# EAGLE design X15-Backplane (EAGLE 9.6.2)

## Sheet 1 of 2
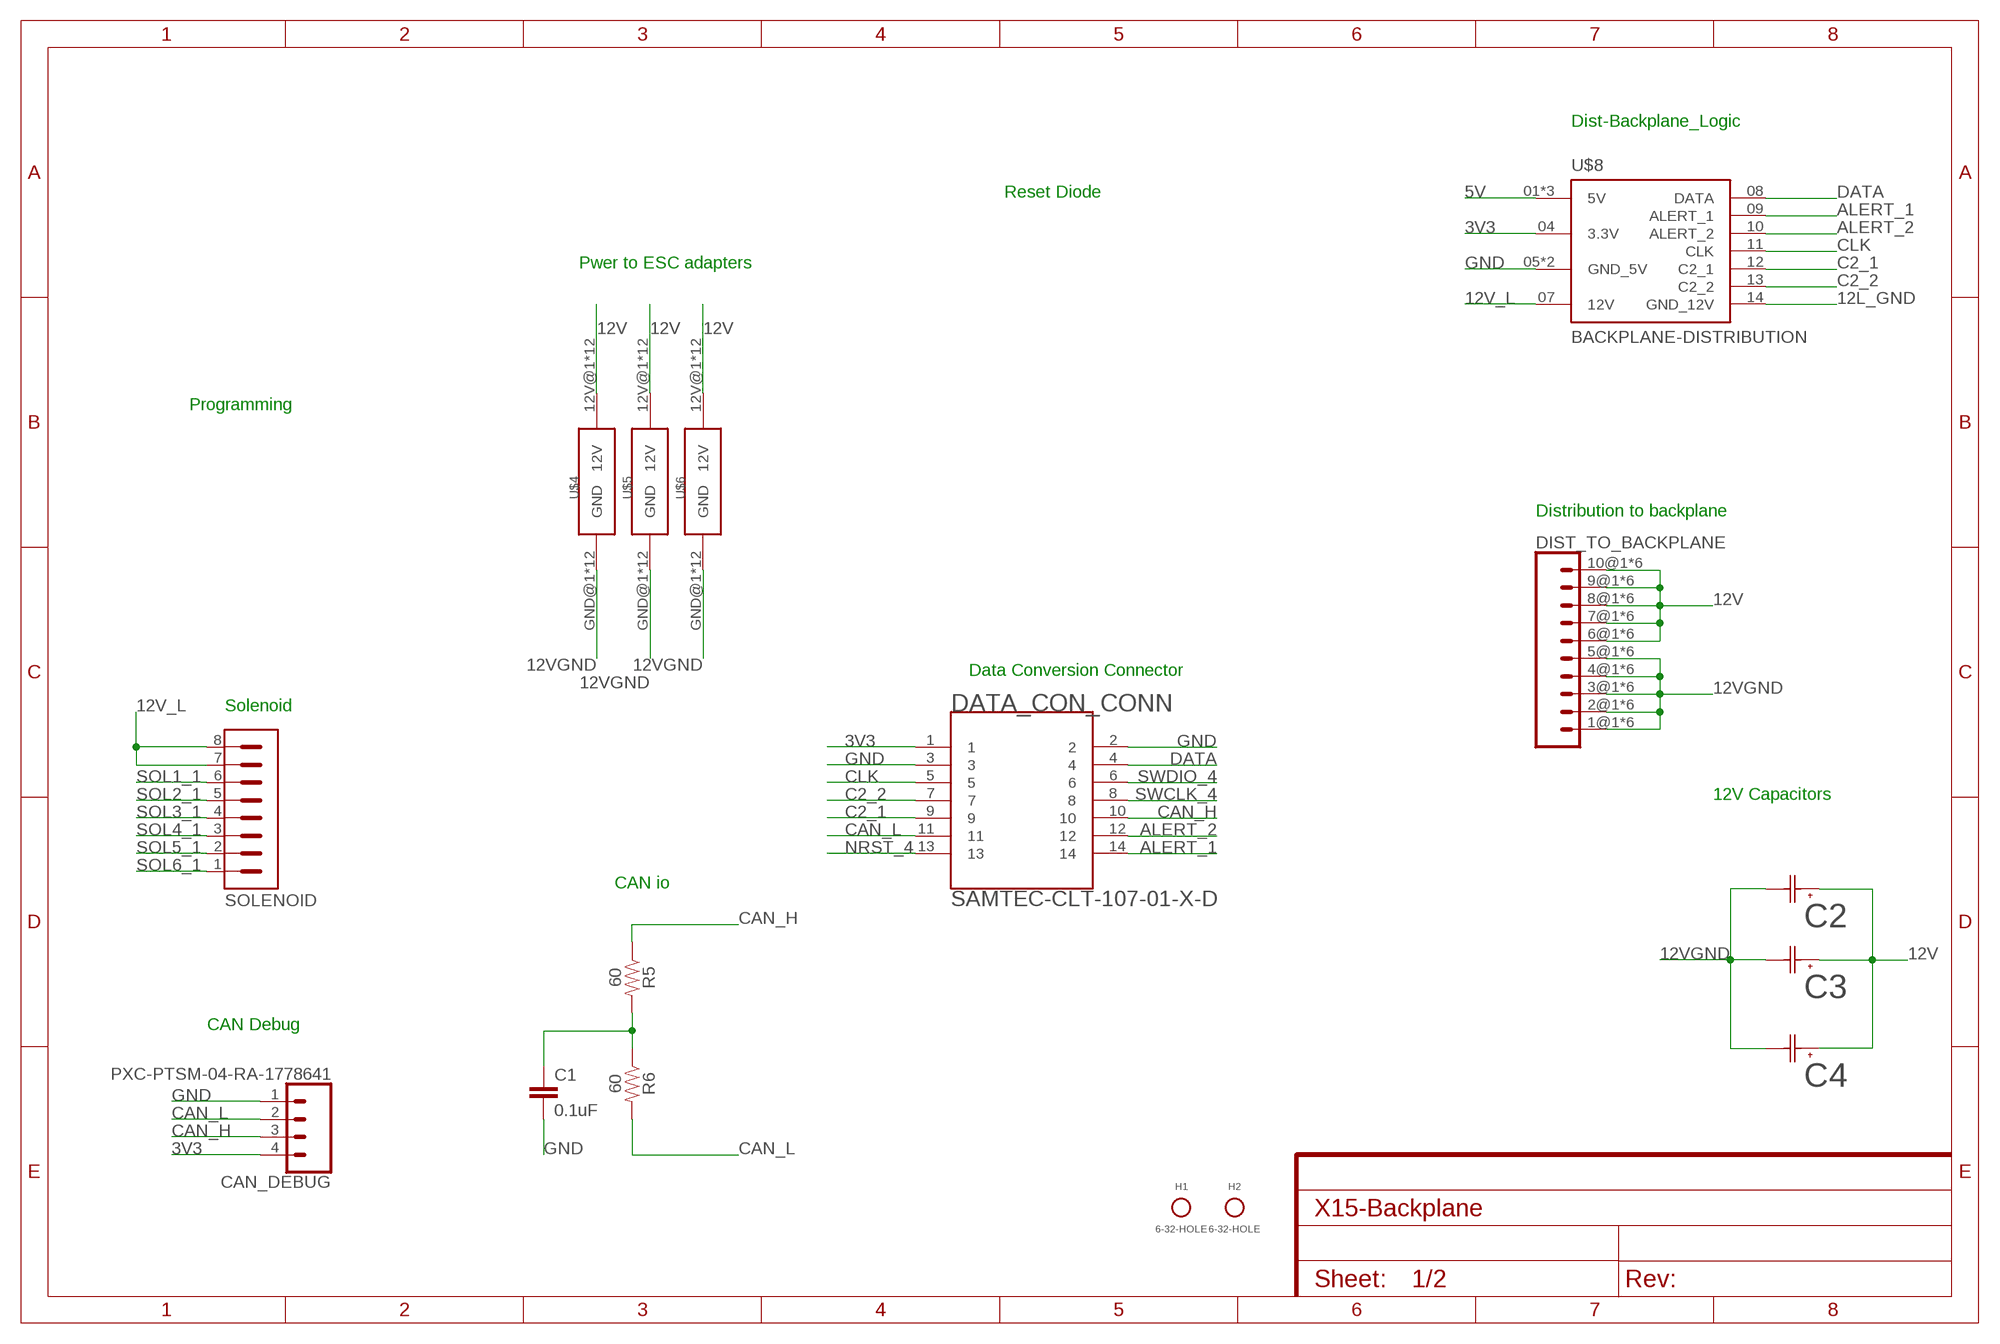
[diagram p0: schematic, sheet 1]

### Parts
C1  0.1uF  0.1UF-0603-100V-10%  [0603]
C2  UCV1E561MNL1GSCAP_UCD_8X10_NCH  [CAP_UCD_8X10_NCH]
C3  UCV1E561MNL1GSCAP_UCD_8X10_NCH  [CAP_UCD_8X10_NCH]
C4  UCV1E561MNL1GSCAP_UCD_8X10_NCH  [CAP_UCD_8X10_NCH]
CAN_DEBUG  PXC-PTSM-04-RA-1778641  [PXC-PTSM-04-RA-1778641]
DATA_CON_CONN  BACKPLANE->DATACONV  [SAMTEC-CLT-107-01-X-D-BACKPLANE]
DIST_TO_BACKPLANE  MPPT-10-01-01-L-RA-SD  [MPPT-10-01-01-L-RA-SD]
H1  6-32-HOLE  [6-32-HOLE]
H2  6-32-HOLE  [6-32-HOLE]
R5  60  RESISTOR0603  [0603]
R6  60  RESISTOR0603  [0603]
SOLENOID  PXC-8-RA-1778683  [PXC-8-RA-1778683]
U$4  BACKPLANE_ESC_ADAPTER_PWRBKP  [BACKPLANE_ESC_ADAPTER_BKP_PWR]
U$5  BACKPLANE_ESC_ADAPTER_PWRBKP  [BACKPLANE_ESC_ADAPTER_BKP_PWR]
U$6  BACKPLANE_ESC_ADAPTER_PWRBKP  [BACKPLANE_ESC_ADAPTER_BKP_PWR]
U$8  BACKPLANE-DISTRIBUTION  [SAMTEC_IPL1-107-01-X-D-K(B-D)]

### Nets
3V3: CAN_DEBUG.4 DATA_CON_CONN.1 U$8.04(3.3V) ; also sheet 2
5V: U$8.01(5V) U$8.02(5V) U$8.03(5V) ; also sheet 2
12L_GND: U$8.14(GND_12V) ; also sheet 2
12V: C2.1 C3.1 C4.1 DIST_TO_BACKPLANE.6@1 DIST_TO_BACKPLANE.6@2 DIST_TO_BACKPLANE.6@3 DIST_TO_BACKPLANE.6@4 DIST_TO_BACKPLANE.6@5 DIST_TO_BACKPLANE.6@6 DIST_TO_BACKPLANE.7@1 DIST_TO_BACKPLANE.7@2 DIST_TO_BACKPLANE.7@3 DIST_TO_BACKPLANE.7@4 DIST_TO_BACKPLANE.7@5 DIST_TO_BACKPLANE.7@6 DIST_TO_BACKPLANE.8@1 DIST_TO_BACKPLANE.8@2 DIST_TO_BACKPLANE.8@3 DIST_TO_BACKPLANE.8@4 DIST_TO_BACKPLANE.8@5 DIST_TO_BACKPLANE.8@6 DIST_TO_BACKPLANE.9@1 DIST_TO_BACKPLANE.9@2 DIST_TO_BACKPLANE.9@3 DIST_TO_BACKPLANE.9@4 DIST_TO_BACKPLANE.9@5 DIST_TO_BACKPLANE.9@6 DIST_TO_BACKPLANE.10@1 DIST_TO_BACKPLANE.10@2 DIST_TO_BACKPLANE.10@3 DIST_TO_BACKPLANE.10@4 DIST_TO_BACKPLANE.10@5 DIST_TO_BACKPLANE.10@6 U$4.12V@1(12V) U$4.12V@2(12V) U$4.12V@3(12V) U$4.12V@4(12V) U$4.12V@5(12V) U$4.12V@6(12V) U$4.12V@7(12V) U$4.12V@8(12V) U$4.12V@9(12V) U$4.12V@10(12V) U$4.12V@11(12V) U$4.12V@12(12V) U$5.12V@1(12V) U$5.12V@2(12V) U$5.12V@3(12V) U$5.12V@4(12V) U$5.12V@5(12V) U$5.12V@6(12V) U$5.12V@7(12V) U$5.12V@8(12V) U$5.12V@9(12V) U$5.12V@10(12V) U$5.12V@11(12V) U$5.12V@12(12V) U$6.12V@1(12V) U$6.12V@2(12V) U$6.12V@3(12V) U$6.12V@4(12V) U$6.12V@5(12V) U$6.12V@6(12V) U$6.12V@7(12V) U$6.12V@8(12V) U$6.12V@9(12V) U$6.12V@10(12V) U$6.12V@11(12V) U$6.12V@12(12V) ; also sheet 2
12V_L: SOLENOID.7 SOLENOID.8 U$8.07(12V) ; also sheet 2
12VGND: C2.2 C3.2 C4.2 DIST_TO_BACKPLANE.1@1 DIST_TO_BACKPLANE.1@2 DIST_TO_BACKPLANE.1@3 DIST_TO_BACKPLANE.1@4 DIST_TO_BACKPLANE.1@5 DIST_TO_BACKPLANE.1@6 DIST_TO_BACKPLANE.2@1 DIST_TO_BACKPLANE.2@2 DIST_TO_BACKPLANE.2@3 DIST_TO_BACKPLANE.2@4 DIST_TO_BACKPLANE.2@5 DIST_TO_BACKPLANE.2@6 DIST_TO_BACKPLANE.3@1 DIST_TO_BACKPLANE.3@2 DIST_TO_BACKPLANE.3@3 DIST_TO_BACKPLANE.3@4 DIST_TO_BACKPLANE.3@5 DIST_TO_BACKPLANE.3@6 DIST_TO_BACKPLANE.4@1 DIST_TO_BACKPLANE.4@2 DIST_TO_BACKPLANE.4@3 DIST_TO_BACKPLANE.4@4 DIST_TO_BACKPLANE.4@5 DIST_TO_BACKPLANE.4@6 DIST_TO_BACKPLANE.5@1 DIST_TO_BACKPLANE.5@2 DIST_TO_BACKPLANE.5@3 DIST_TO_BACKPLANE.5@4 DIST_TO_BACKPLANE.5@5 DIST_TO_BACKPLANE.5@6 U$4.GND@1(GND) U$4.GND@2(GND) U$4.GND@3(GND) U$4.GND@4(GND) U$4.GND@5(GND) U$4.GND@6(GND) U$4.GND@7(GND) U$4.GND@8(GND) U$4.GND@9(GND) U$4.GND@10(GND) U$4.GND@11(GND) U$4.GND@12(GND) U$5.GND@1(GND) U$5.GND@2(GND) U$5.GND@3(GND) U$5.GND@4(GND) U$5.GND@5(GND) U$5.GND@6(GND) U$5.GND@7(GND) U$5.GND@8(GND) U$5.GND@9(GND) U$5.GND@10(GND) U$5.GND@11(GND) U$5.GND@12(GND) U$6.GND@1(GND) U$6.GND@2(GND) U$6.GND@3(GND) U$6.GND@4(GND) U$6.GND@5(GND) U$6.GND@6(GND) U$6.GND@7(GND) U$6.GND@8(GND) U$6.GND@9(GND) U$6.GND@10(GND) U$6.GND@11(GND) U$6.GND@12(GND)
ALERT_1: DATA_CON_CONN.14 U$8.09(ALERT_1)
ALERT_2: DATA_CON_CONN.12 U$8.10(ALERT_2)
C2_1: DATA_CON_CONN.9 U$8.12(C2_1)
C2_2: DATA_CON_CONN.7 U$8.13(C2_2)
CAN_H: CAN_DEBUG.3 DATA_CON_CONN.10 R5.1 ; also sheet 2
CAN_L: CAN_DEBUG.2 DATA_CON_CONN.11 R6.2 ; also sheet 2
CLK: DATA_CON_CONN.5 U$8.11(CLK)
DATA: DATA_CON_CONN.4 U$8.08(DATA)
GND: C1.2 CAN_DEBUG.1 DATA_CON_CONN.2 DATA_CON_CONN.3 U$8.05(GND_5V) U$8.06(GND_5V) ; also sheet 2
N$4: C1.1 R5.2 R6.1
NRST_4: DATA_CON_CONN.13
SOL1_1: SOLENOID.6 ; also sheet 2
SOL2_1: SOLENOID.5 ; also sheet 2
SOL3_1: SOLENOID.4 ; also sheet 2
SOL4_1: SOLENOID.3 ; also sheet 2
SOL5_1: SOLENOID.2 ; also sheet 2
SOL6_1: SOLENOID.1 ; also sheet 2
SWCLK_4: DATA_CON_CONN.8
SWDIO_4: DATA_CON_CONN.6

### Notes on the sheet
- Dist-Backplane_Logic
- Reset Diode
- Pwer to ESC adapters
- Programming
- Distribution to backplane
- Data Conversion Connector
- Solenoid
- 12V Capacitors
- CAN io
- CAN Debug

## Sheet 2 of 2
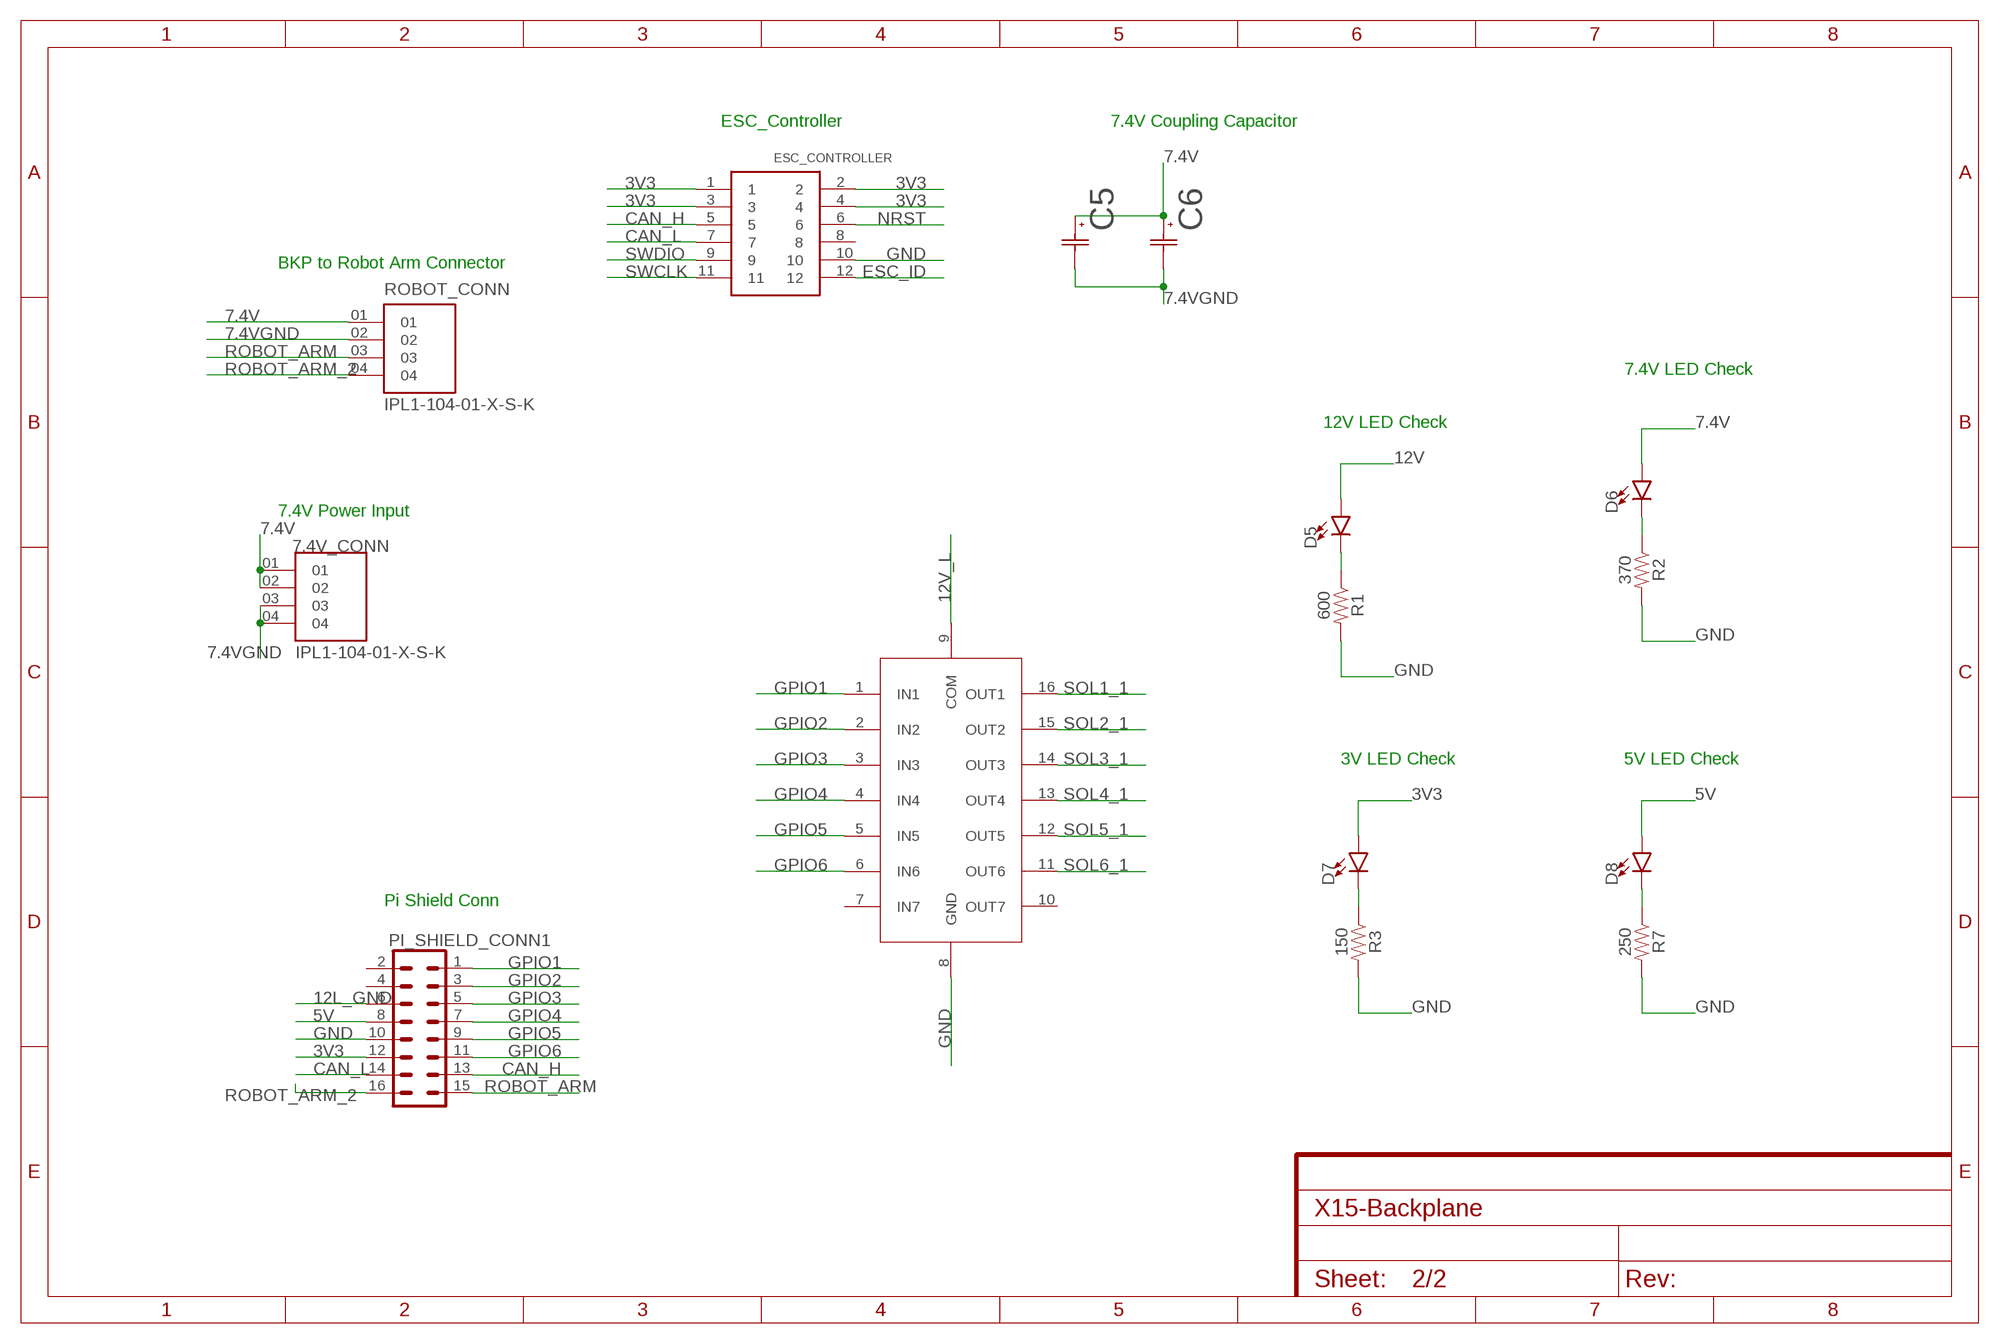
[diagram p1: schematic, sheet 2]

### Parts
7.4V_CONN  IPL1-104-01-X-S-K  [SAMTEC_IPL1-104-01-X-S-K]
C5  UCV1E561MNL1GSCAP_UCD_8X10_NCH  [CAP_UCD_8X10_NCH]
C6  UCV1E561MNL1GSCAP_UCD_8X10_NCH  [CAP_UCD_8X10_NCH]
D5  LED0603  [LED-0603]
D6  LED0603  [LED-0603]
D7  LED0603  [LED-0603]
D8  LED0603  [LED-0603]
ESC_CONTROLLER  BACKPLANE_CONNECTORSBKP  [BACKPLANE_CONNECTORS_BKP]
PI_SHIELD_CONN1  8X_CONN  [IPL7X2]
R1  600  RESISTOR0603  [0603]
R2  370  RESISTOR0603  [0603]
R3  150  RESISTOR0603  [0603]
R7  250  RESISTOR0603  [0603]
ROBOT_CONN  IPL1-104-01-X-S-K  [SAMTEC_IPL1-104-01-X-S-K]
U1  ULN2003AD  [16-SOIC]

### Nets
3V3: D7.A ESC_CONTROLLER.1 ESC_CONTROLLER.2 ESC_CONTROLLER.3 ESC_CONTROLLER.4 PI_SHIELD_CONN1.12 ; also sheet 1
5V: D8.A PI_SHIELD_CONN1.8 ; also sheet 1
7.4V: 7.4V_CONN.01 7.4V_CONN.02 C5.1 C6.1 D6.A ROBOT_CONN.01
7.4VGND: 7.4V_CONN.03 7.4V_CONN.04 C5.2 C6.2 ROBOT_CONN.02
12L_GND: PI_SHIELD_CONN1.6 ; also sheet 1
12V: D5.A ; also sheet 1
12V_L: U1.9(COM) ; also sheet 1
CAN_H: ESC_CONTROLLER.5 PI_SHIELD_CONN1.13 ; also sheet 1
CAN_L: ESC_CONTROLLER.7 PI_SHIELD_CONN1.14 ; also sheet 1
ESC_ID: ESC_CONTROLLER.12
GND: ESC_CONTROLLER.10 PI_SHIELD_CONN1.10 R1.2 R2.2 R3.2 R7.2 U1.8(GND) ; also sheet 1
GPIO1: PI_SHIELD_CONN1.1 U1.1(IN1)
GPIO2: PI_SHIELD_CONN1.3 U1.2(IN2)
GPIO3: PI_SHIELD_CONN1.5 U1.3(IN3)
GPIO4: PI_SHIELD_CONN1.7 U1.4(IN4)
GPIO5: PI_SHIELD_CONN1.9 U1.5(IN5)
GPIO6: PI_SHIELD_CONN1.11 U1.6(IN6)
N$1: D6.C R2.1
N$2: D5.C R1.1
N$3: D7.C R3.1
N$5: D8.C R7.1
NRST: ESC_CONTROLLER.6
ROBOT_ARM: PI_SHIELD_CONN1.15 ROBOT_CONN.03
ROBOT_ARM_2: PI_SHIELD_CONN1.16 ROBOT_CONN.04
SOL1_1: U1.16(OUT1) ; also sheet 1
SOL2_1: U1.15(OUT2) ; also sheet 1
SOL3_1: U1.14(OUT3) ; also sheet 1
SOL4_1: U1.13(OUT4) ; also sheet 1
SOL5_1: U1.12(OUT5) ; also sheet 1
SOL6_1: U1.11(OUT6) ; also sheet 1
SWCLK: ESC_CONTROLLER.11
SWDIO: ESC_CONTROLLER.9
Unconnected: ESC_CONTROLLER.8 PI_SHIELD_CONN1.2 PI_SHIELD_CONN1.4 U1.7(IN7) U1.10(OUT7)

### Notes on the sheet
- ESC_Controller | 7.4V Coupling Capacitor
- BKP to Robot Arm Connector
- 7.4V LED Check
- 12V LED Check
- 7.4V Power Input
- 3V LED Check | 5V LED Check
- Pi Shield Conn

## Library data of the parts
7.4V_CONN ROBOT_CONN = X15-Backplane Parts:IPL1-104-01-X-S-K; MANUFACTURER: SAMTEC; PARTREV: E
C1 = SparkFun-Capacitors:0.1UF: 0.1µF ceramic capacitors A capacitor is a passive two-terminal electrical component used to store electrical energy temporarily in an electric field.; PROD_ID: CAP-08390
C2-C6 = 2023-01-03_19-29-37_Library:UCV1E561MNL1GS; COPYRIGHT: Copyright (C) 2023 Ultra Librarian. All rights reserved.; DIGI-KEY_PART_NUMBER_1: 493-14353-1-ND; DIGI-KEY_PART_NUMBER_2: 493-14353-2-ND; DIGI-KEY_PART_NUMBER_3: 493-14353-6-ND; MANUFACTURER_PART_NUMBER: UCV1E561MNL1GS; MFR_NAME: Nichicon
CAN_DEBUG = X15-Backplane Parts:PXC-PTSM-04-RA-1778641
D5-D8 = SparkFun-LED:LED: LED (Generic) Standard schematic elements and footprints for 5mm, 3mm, 1206, and 0603 sized LEDs. Generic LEDs with no color specified.
DATA_CON_CONN = X15-Backplane Parts:BACKPLANE->DATACONV
DIST_TO_BACKPLANE = X15-Backplane Parts:MPPT-10-01-01-L-RA-SD: Samtec MPPT Connector Right Angle Vertically mating Non-gendered https://www.samtec.com/products/mppt-10-01-01-l-ra-sd
ESC_CONTROLLER = X15-Backplane Parts:BACKPLANE_CONNECTORS: Use samtec TMM and MMS
H1 H2 = X15-Backplane Parts:6-32-HOLE
PI_SHIELD_CONN1 = X15-Backplane Parts:8X_CONN
R1-R3 R5-R7 = SparkFun-Resistors:RESISTOR: Generic Resistor Package
SOLENOID = X15-Backplane Parts:PXC-8-RA-1778683; SPICEPREFIX: X
U1 = X15-Pi-Shield-Parts:ULN2003AD; A1_MIN: 0.25; A_MAX: 1.75; A_MIN: 1.75; A_NOM: 1.75; B_MAX: 0.51; B_MIN: 0.33; B_NOM: 0.42; D2_MAX: 0.0; D_MAX: 10.0; D_MIN: 9.8; D_NOM: 9.9; E1_MAX: 4.0; E1_MIN: 3.8; E1_NOM: 3.9; E2_MAX: 0.0; ENOM: 1.27; E_MAX: 6.2; E_MIN: 5.8; E_NOM: 6.0; L_MAX: 1.27; L_MIN: 0.38; L_NOM: 0.825; MANUFACTURER: Diodes Inc.; PIN_COUNT: 16.0; SNAPEDA_PACKAGE_ID: 27538; STANDARD: IPC 7351B
U$4-U$6 = X15-Backplane Parts:BACKPLANE_ESC_ADAPTER_PWR
U$8 = X15-Backplane Parts:BACKPLANE-DISTRIBUTION

## Board
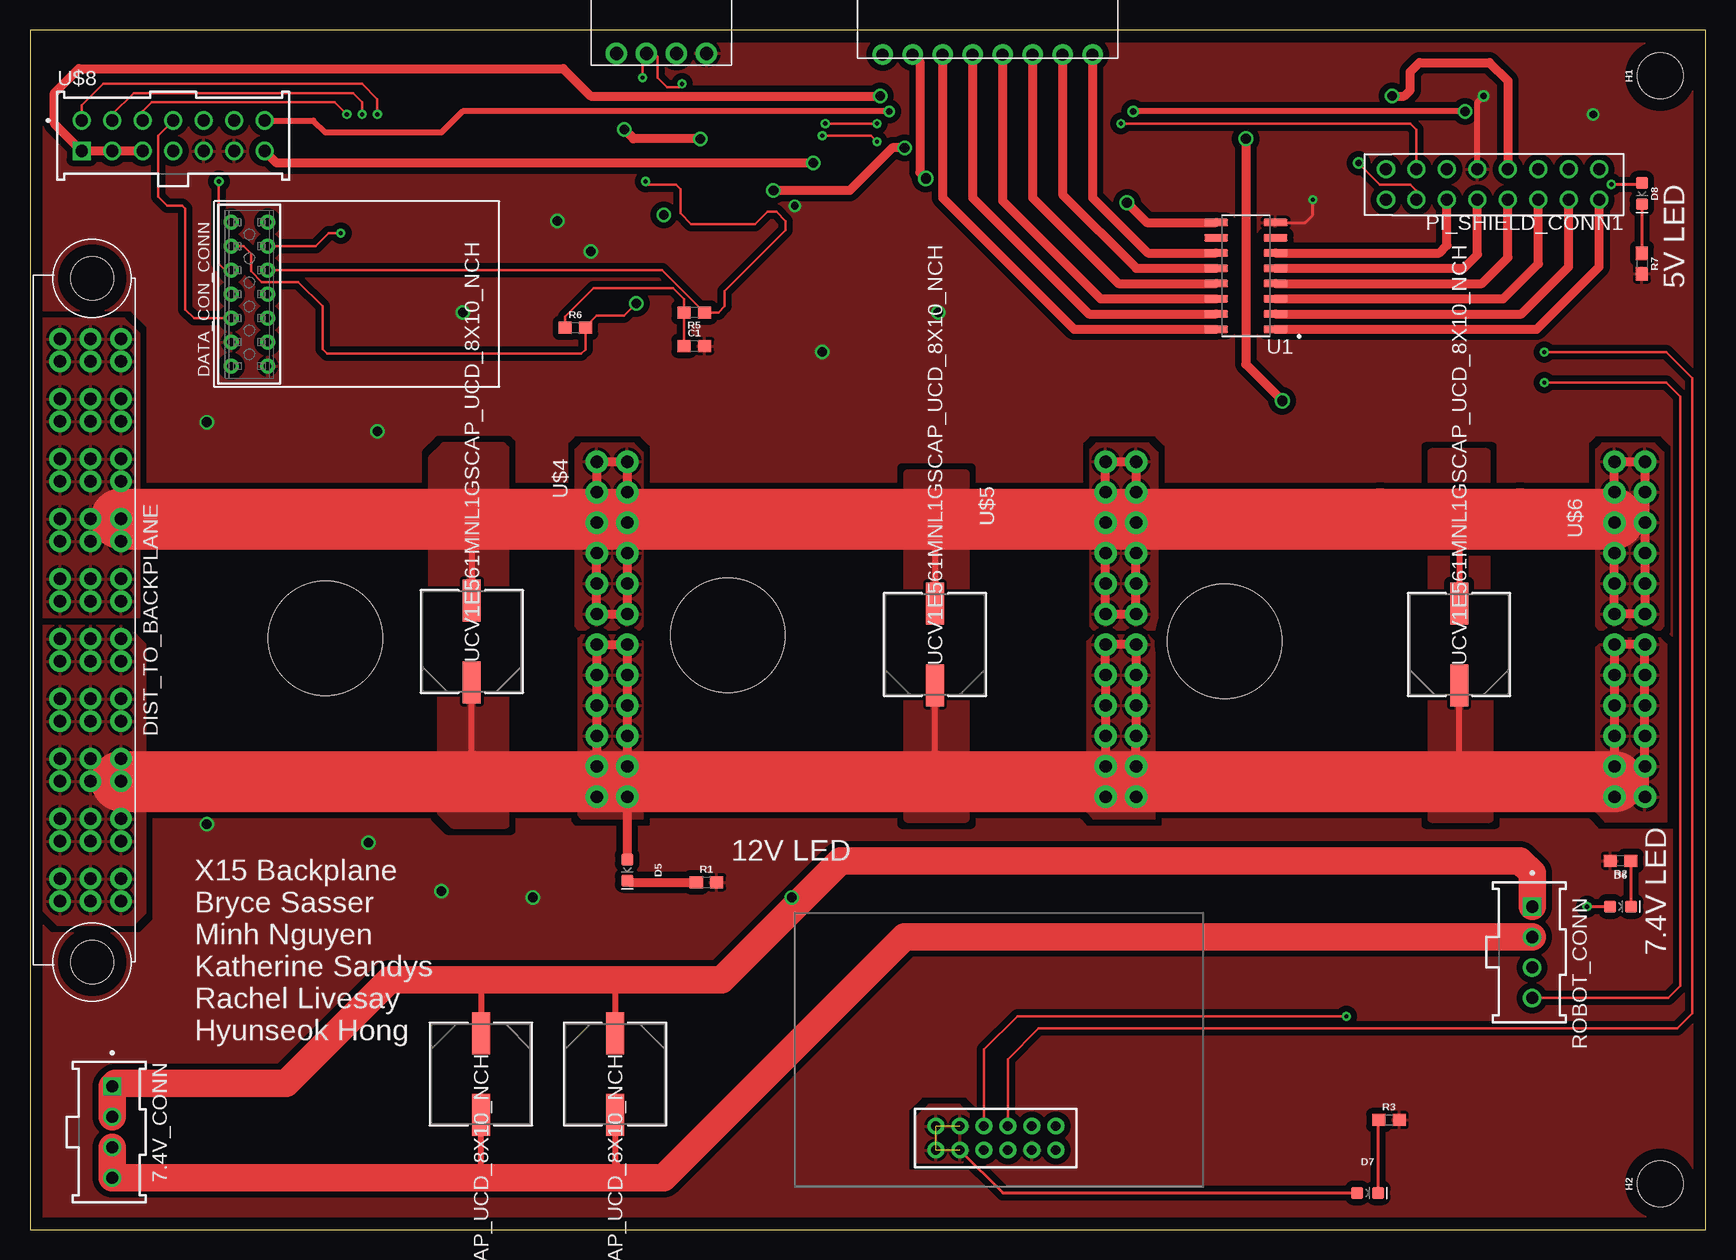
[diagram p2: board, top side]
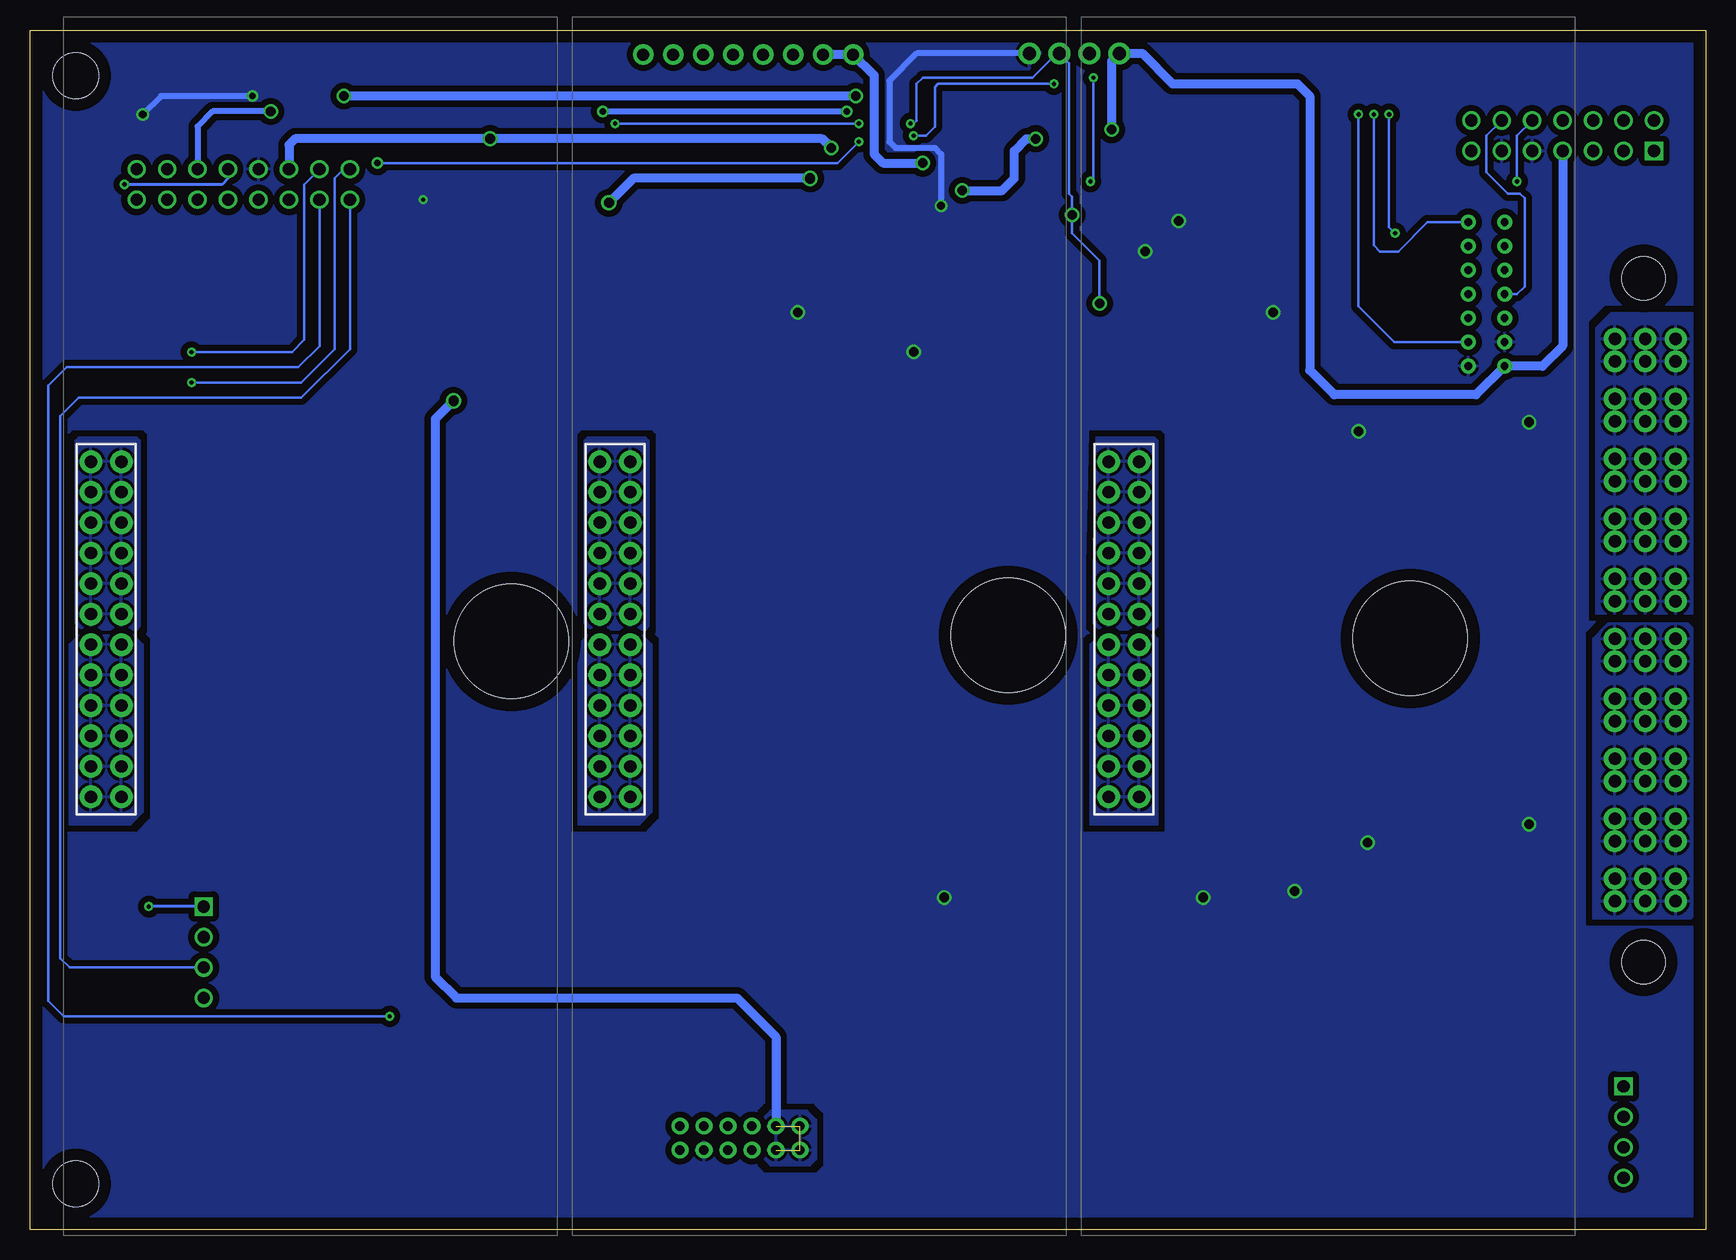
[diagram p3: board, bottom side, seen from below]

Size 139.7 x 100 mm. Coordinates in mm from the lower left corner, seen from the top.
Outline: 0,0 139.7,0 139.7,100 0,100 0,0
Copper layers (1*16): Top 0.035mm / dielectric 1.5mm / Bottom 0.035mm
Design rules "477": minimum track width 6mil, minimum drill 0.35mm, track to track 6mil, track to pad 6mil, pad to pad 6mil, via to via 6mil, smd to smd 6mil, copper to edge 40mil, drill to drill 6mil, minimum pad ring 10mil, minimum via ring 8mil, stop-mask expansion 4mil, vias tented up to drill 0mil, thermal gap 10mil
Holes 9.53 mm at 24.64,49.28 58.17,49.53 99.57,49.02

### Footprints (pad centres in the part's own frame; a part is rotated, then mirrored left to right if it is on the bottom)
SAMTEC_IPL1-104-01-X-S-K = drill 1.02 square: 01 -3.81,0 | drill 1.02: 02 -1.27,0; 03 1.27,0; 04 3.81,0
0603 = smd 1.1 x 1: 1 -0.85,0; 2 0.85,0
CAP_UCD_8X10_NCH = smd 3.505 x 1.499: 1 -3.404,0; 2 3.404,0
PXC-PTSM-04-RA-1778641 = drill 1.1 pad 1.8: 1 0,0; 2 2.5,0; 3 5,0; 4 7.5,0
LED-0603 = smd 1 x 1: A -0.877,0; C 0.877,0
SAMTEC-CLT-107-01-X-D-BACKPLANE = drill 0.64 pad 1.24: 1 -6,1.511; 2 -6,-1.511; 3 -4,1.511; 4 -4,-1.511; 5 -2,1.511; 6 -2,-1.511; 7 0,1.511; 8 0,-1.511; 9 2,1.511; 10 2,-1.511; 11 4,1.511; 12 4,-1.511; 13 6,1.511; 14 6,-1.511
MPPT-10-01-01-L-RA-SD = drill 1.04 pad 1.8: 1@1 -23.44,2.26; 1@2 -21.56,2.26; 1@3 -23.44,4.8; 1@4 -21.56,4.8; 1@5 -23.44,7.34; 1@6 -21.56,7.34; 2@1 -18.44,2.26; 2@2 -16.56,2.26; 2@3 -18.44,4.8; 2@4 -16.56,4.8; 2@5 -18.44,7.34; 2@6 -16.56,7.34; 3@1 -13.44,2.26; 3@2 -11.56,2.26; 3@3 -13.44,4.8; 3@4 -11.56,4.8; 3@5 -13.44,7.34; 3@6 -11.56,7.34; 4@1 -8.44,2.26; 4@2 -6.56,2.26; 4@3 -8.44,4.8; 4@4 -6.56,4.8; 4@5 -8.44,7.34; 4@6 -6.56,7.34; 5@1 -3.44,2.26; 5@2 -1.56,2.26; 5@3 -3.44,4.8; 5@4 -1.56,4.8; 5@5 -3.44,7.34; 5@6 -1.56,7.34; 6@1 1.56,2.26; 6@2 3.44,2.26; 6@3 1.56,4.8; 6@4 3.44,4.8; 6@5 1.56,7.34; 6@6 3.44,7.34; 7@1 6.56,2.26; 7@2 8.44,2.26; 7@3 6.56,4.8; 7@4 8.44,4.8; 7@5 6.56,7.34; 7@6 8.44,7.34; 8@1 11.56,2.26; 8@2 13.44,2.26; 8@3 11.56,4.8; 8@4 13.44,4.8; 8@5 11.56,7.34; 8@6 13.44,7.34; 9@1 16.56,2.26; 9@2 18.44,2.26; 9@3 16.56,4.8; 9@4 18.44,4.8; 9@5 16.56,7.34; 9@6 18.44,7.34; 10@1 21.56,2.26; 10@2 23.44,2.26; 10@3 21.56,4.8; 10@4 23.44,4.8; 10@5 21.56,7.34; 10@6 23.44,7.34 | hole 3.6: 28.5,4.93; -28.5,4.93
BACKPLANE_CONNECTORS_BKP = drill 0.79 pad 1.39: 1 -1,-5; 2 1,-5; 3 -1,-3; 4 1,-3; 5 -1,-1; 6 1,-1; 7 -1,1; 8 1,1; 9 -1,3; 10 1,3; 11 -1,5; 12 1,5
6-32-HOLE = hole 3.81: 0,0
IPL7X2 = drill 1.016 pad 1.524: 1 2.032,3.81; 2 2.032,1.27; 3 4.572,3.81; 4 4.572,1.27; 5 7.112,3.81; 6 7.112,1.27; 7 9.652,3.81; 8 9.652,1.27; 9 12.192,3.81; 10 12.192,1.27; 11 14.732,3.81; 12 14.732,1.27; 13 17.272,3.81; 14 17.272,1.27; 15 19.812,3.81; 16 19.812,1.27
PXC-8-RA-1778683 = drill 1 pad 1.7: 1 2.1,7.2; 2 4.6,7.2; 3 7.1,7.2; 4 9.6,7.2; 5 12.1,7.2; 6 14.6,7.2; 7 17.1,7.2; 8 19.6,7.2
16-SOIC = smd 1.97 x 0.6: 1 -2.475,4.445; 2 -2.475,3.175; 3 -2.475,1.905; 4 -2.475,0.635; 5 -2.475,-0.635; 6 -2.475,-1.905; 7 -2.475,-3.175; 8 -2.475,-4.445; 9 2.475,-4.445; 10 2.475,-3.175; 11 2.475,-1.905; 12 2.475,-0.635; 13 2.475,0.635; 14 2.475,1.905; 15 2.475,3.175; 16 2.475,4.445
BACKPLANE_ESC_ADAPTER_BKP_PWR = drill 1.016 pad 1.88: 12V@1 65.024,36.322; 12V@2 65.024,38.862; 12V@3 62.484,36.322; 12V@4 62.484,38.862; 12V@5 59.944,36.322; 12V@6 59.944,38.862; 12V@7 57.404,36.322; 12V@8 57.404,38.862; 12V@9 54.864,36.322; 12V@10 54.864,38.862; 12V@11 52.324,36.322; 12V@12 52.324,38.862; GND@1 49.784,38.862; GND@2 49.784,36.322; GND@3 47.244,38.862; GND@4 47.244,36.322; GND@5 44.704,38.862; GND@6 44.704,36.322; GND@7 42.164,38.862; GND@8 42.164,36.322; GND@9 39.624,38.862; GND@10 39.624,36.322; GND@11 37.084,38.862; GND@12 37.084,36.322
SAMTEC_IPL1-107-01-X-D-K(B-D) = drill 1.02 square: 01 -7.62,-1.27 | drill 1.02: 02 -5.08,-1.27; 03 -2.54,-1.27; 04 0,-1.27; 05 2.54,-1.27; 06 5.08,-1.27; 07 7.62,-1.27; 08 -7.62,1.27; 09 -5.08,1.27; 10 -2.54,1.27; 11 0,1.27; 12 2.54,1.27; 13 5.08,1.27; 14 7.62,1.27

### Placement (x,y rotation side)
7.4V_CONN  6.86,8.13 270 top
C1  55.37,73.66 0 top
C2  36.83,49.02 90 top
C3  75.44,48.77 90 top
C4  119.13,48.77 90 top
C5  37.59,12.95 270 top
C6  48.77,12.95 270 top
CAN_DEBUG  56.39,98.04 180 top
D5  49.78,29.97 270 top
D6  132.59,26.92 0 top
D7  111.51,3.05 0 top
D8  134.37,86.36 270 top
DATA_CON_CONN  18.29,77.98 90 top
DIST_TO_BACKPLANE  0.25,50.8 270 top
ESC_CONTROLLER  80.52,7.62 270 top
H1  135.89,96.19 90 top
H2  135.89,3.81 90 top
PI_SHIELD_CONN1  132.84,89.66 180 top
R1  56.39,28.96 0 top
R2  132.59,30.73 180 top
R3  113.28,9.14 0 top
R5  55.37,76.45 180 top
R6  45.47,75.18 0 top
R7  134.37,80.52 270 top
ROBOT_CONN  125.22,23.11 270 top
SOLENOID  90.68,105.16 180 top
U1  101.35,79.5 180 top
U$4  10.92,101.09 270 top
U$5  53.34,101.09 270 top
U$6  95.76,101.09 270 top
U$8  11.94,91.19 0 top

### Tracks (layer width: path | path; a pad name or v marks a point on that pad's centre or on a via)
3V3  (via drill 0.8, 0.85)  (3 unrouted)
  Top 0.254: ESC_CONTROLLER.4 81.09,3.05 D7.A
  Top 0.762: v72.9,90.17 71.88,90.17 68.33,86.61 v61.98,86.61 | v55.88,90.93 50.29,90.93 v49.53,91.69 | v104.39,69.09 101.35,72.14 v101.35,90.93
  Bottom 0.762: U$8.04 11.94,73.66 13.62,71.98 DATA_CON_CONN.1 19.16,69.6 30.99,69.6 33.02,71.63 33.02,94.49 34.04,95.5 44.45,95.5 46.99,98.04 CAN_DEBUG.4 49.53,97.4 v49.53,91.69 | v72.9,90.17 73.66,90.93 v101.35,90.93 117.6,90.93 118.11,90.42 PI_SHIELD_CONN1.12 | v61.98,86.61 58.67,86.61 57.66,87.63 57.66,89.92 56.64,90.93 v55.88,90.93 | v104.39,69.09 105.92,67.56 105.92,21.08 104.14,19.3 80.77,19.3 77.52,16.05 ESC_CONTROLLER.3
  pour Bottom (isolate 0.508): 74.93,9.91 74.17,9.14 74.17,5.84 74.68,5.33 77.98,5.33 78.49,5.84 78.49,9.4 77.98,9.91
  pour Top (isolate 0.508): 74.93,10.41 73.91,9.4 73.91,5.59 77.72,5.59 78.23,6.1 78.23,9.65 77.47,10.41
5V  (via drill 0.35, 0.8)
  Top 0.254: D8.A 134.25,87.12 v131.83,87.12
  Top 0.762: U$8.03 U$8.02 U$8.01 2.03,92.2 2.03,94.74 4.06,96.77 44.45,96.77 46.74,94.49 v70.87,94.49 | PI_SHIELD_CONN1.8 123.19,95.76 121.67,97.28 115.82,97.28 115.06,96.52 115.06,95 114.55,94.49 v113.54,94.49
  Bottom 0.254: PI_SHIELD_CONN1.8 123.19,87.63 123.7,87.12 v131.83,87.12
  Bottom 0.762: v70.87,94.49 v113.54,94.49
7.4V  (via drill 0.35)
  Top 0.254: v129.79,26.92 D6.A
  Top 0.508: 37.59,20.83 C5.1 | 48.77,20.83 C6.1
  Top 2.286: 7.4V_CONN.02 7.4V_CONN.01 7.11,12.19 21.34,12.19 29.97,20.83 37.59,20.83 48.77,20.83 57.66,20.83 67.56,30.73 124.21,30.73 125.22,29.72 ROBOT_CONN.01
  Bottom 0.254: ROBOT_CONN.01 v129.79,26.92
7.4VGND
  Top 0.508: 37.59,4.32 C5.2 | 50.04,4.32 48.77,5.59 C6.2
  Top 2.286: 7.4V_CONN.03 7.4V_CONN.04 37.59,4.32 50.04,4.32 52.83,4.32 72.9,24.38 ROBOT_CONN.02
12GND
  pour Top (isolate 0.508): 116.84,64.77 116.84,49.43 121.41,49.43 121.41,64.77
12L_GND  (via drill 0.55, 0.8)
  Top 0.508: U$8.14 23.62,92.46 24.64,91.44 34.29,91.44 36.07,93.22 v71.63,93.22 | v119.63,93.22 v91.95,93.22
  Bottom 0.508: v119.63,93.22 124.46,93.22 125.73,91.95 PI_SHIELD_CONN1.6 | v91.95,93.22 v71.63,93.22
12V
  Top 0.508: 36.83,37.36 C2.1 | 75.44,37.36 C3.1 | 119.13,37.34 C4.1
  Top 0.762: U$5.12V@9 U$5.12V@11 U$5.12V@12 U$5.12V@10 U$5.12V@8 U$5.12V@6 U$5.12V@4 92.2,37.34 U$5.12V@2 U$5.12V@1 89.66,37.34 | U$5.12V@3 U$5.12V@5 U$5.12V@7 U$5.12V@9 | U$5.12V@9 U$5.12V@3 | 47.24,37.59 U$4.12V@3 U$4.12V@5 U$4.12V@7 U$4.12V@9 U$4.12V@11 U$4.12V@12 U$4.12V@10 U$4.12V@8 U$4.12V@6 U$4.12V@4 49.78,37.34 | 47.24,37.59 U$4.12V@1 U$4.12V@2 | 49.78,37.34 U$4.12V@2 | 47.01,37.36 47.24,37.59 | 49.76,37.36 49.78,37.34 | U$5.12V@3 89.66,37.34 | 89.64,37.36 89.66,37.34 | DIST_TO_BACKPLANE.8@6 7.62,37.36 | U$4.12V@2 D5.A | U$6.12V@11 U$6.12V@9 U$6.12V@7 U$6.12V@5 U$6.12V@3 132.08,37.34 U$6.12V@1 U$6.12V@2 U$6.12V@4 U$6.12V@6 U$6.12V@8 U$6.12V@10 U$6.12V@12 U$6.12V@11
  Top 5.08: 7.62,37.36 36.83,37.36 47.01,37.36 49.76,37.36 75.44,37.36 89.64,37.36 | 89.66,37.34 92.2,37.34 119.13,37.34 132.08,37.34
  pour Bottom (isolate 0.508): 1.27,50.29 -0.25,48.77 -0.25,27.43 1.27,25.91 9.4,25.91 9.4,49.28 8.38,50.29 8.13,50.55 1.52,50.55
  pour Top (isolate 0.508): 1.02,50.29 -0.51,48.77 -0.51,28.19 2.29,25.4 8.64,25.4 9.65,26.42 9.65,26.67 9.65,48.77 8.13,50.29
  pour Top (isolate 0.508): 45.97,49.53 45.72,49.28 45.72,34.54 45.97,34.29 51.05,34.29 51.05,49.02 50.55,49.53
  pour Bottom: 45.97,49.53 45.97,34.04 46.23,33.78 51.31,33.78 51.31,48.77 50.55,49.53
  pour Bottom (isolate 0.508): 45.97,49.53 45.72,49.28 45.72,33.78 51.31,33.78 51.31,48.77 50.55,49.53
  pour Bottom (isolate 0.508): 88.65,49.53 87.88,48.77 87.88,34.8 88.9,33.78 89.15,33.78 93.98,33.78 93.98,48.77 93.22,49.53
  pour Bottom (isolate 0.508): 131.06,49.53 130.3,48.77 130.3,34.8 131.32,33.78 131.57,33.78 136.4,33.78 136.4,48.77 135.64,49.53
  pour Top (isolate 0.508): 88.65,49.53 88.14,49.02 88.14,34.8 88.65,34.29 93.73,34.29 93.73,49.02 93.22,49.53
  pour Top (isolate 0.508): 131.32,49.28 130.56,48.51 130.56,34.8 131.32,34.04 136.4,34.04 136.4,48.77 135.89,49.28
  pour Top (isolate 0.508): 34.29,48.51 34.29,34.8 35.31,33.78 39.62,33.78 39.62,48.51
  pour Top (isolate 0.508): 73.15,48.01 73.15,34.29 77.98,34.29 77.98,48.01
  pour Top (isolate 0.508): 116.84,47.75 116.84,34.29 121.67,34.29 121.67,47.75
12V_L  (via drill 0.8, 0.85)
  Top 0.762: U$8.07 20.57,88.9 v65.28,88.9 | SOLENOID.7 74.17,97.37 74.17,88.14 v74.68,87.63 | v91.44,85.6 93.09,83.95 U1.9
  Bottom 0.762: SOLENOID.7 SOLENOID.8 69.34,96.22 69.34,89.66 68.58,88.9 v65.28,88.9 | v74.68,87.63 89.41,87.63 v91.44,85.6
12VGND
  Top 0.508: 36.83,59.24 C2.2 | 75.18,59.24 75.44,58.99 C3.2 | 119.13,59.24 C4.2
  Top 0.762: 92.2,59.18 U$5.GND@7 U$5.GND@5 U$5.GND@3 U$5.GND@1 U$5.GND@2 U$5.GND@4 U$5.GND@6 U$5.GND@8 89.66,59.44 | 92.2,59.18 U$5.GND@9 U$5.GND@11 U$5.GND@12 89.66,59.44 | U$4.GND@8 U$4.GND@6 U$4.GND@4 U$4.GND@2 U$4.GND@1 U$4.GND@3 U$4.GND@5 U$4.GND@7 | U$4.GND@8 U$4.GND@10 U$4.GND@12 U$4.GND@11 U$4.GND@9 U$4.GND@7 | 132.08,59.18 U$6.GND@8 U$6.GND@6 U$6.GND@4 U$6.GND@2 U$6.GND@1 U$6.GND@3 U$6.GND@5 U$6.GND@7 U$6.GND@9 U$6.GND@11 U$6.GND@12 U$6.GND@10 132.08,59.18 | 46.93,59.24 U$4.GND@8 | 49.47,59.24 U$4.GND@7 | 89.47,59.24 89.66,59.44 | 92.14,59.24 92.2,59.18 | 132.02,59.24 132.08,59.18
  Top 5.08: DIST_TO_BACKPLANE.4@5 36.83,59.24 46.93,59.24 49.47,59.24 75.18,59.24 89.47,59.24 92.14,59.24 112.52,59.24 119.13,59.24 124.21,59.24 132.02,59.24
  pour Top (isolate 0.508): -0.51,52.07 0.51,51.05 9.14,51.05 9.14,74.68 7.87,75.95 1.02,75.95 -0.51,74.42
  pour Bottom (isolate 0.508): -0.25,75.18 -0.25,52.32 0.76,51.31 9.14,51.31 9.14,75.18 7.87,76.45 1.02,76.45
  pour Top (isolate 0.508): 50.29,65.53 45.97,65.53 45.47,65.02 45.47,50.29 45.72,50.04 50.8,50.04 51.05,50.29 51.05,64.77
  pour Bottom (isolate 0.508): 45.97,66.04 45.72,65.79 45.72,50.29 45.97,50.04 50.55,50.04 51.05,50.55 51.05,54.86 50.8,66.04
  pour Bottom (isolate 0.508): 88.39,66.04 88.14,65.79 88.14,50.29 88.39,50.04 92.96,50.04 93.47,50.55 93.47,65.79 93.22,66.04
  pour Bottom (isolate 0.508): 130.81,66.04 130.56,65.79 130.56,50.29 130.81,50.04 135.38,50.04 135.89,50.55 135.89,65.79 135.64,66.04
  pour Top (isolate 0.508): 93.22,65.53 88.9,65.53 88.39,65.02 88.39,50.29 88.65,50.04 93.73,50.04 93.98,50.29 93.98,64.77
  pour Top (isolate 0.508): 135.38,65.53 131.06,65.53 130.56,65.02 130.56,50.29 130.81,50.04 135.89,50.04 136.14,50.29 136.14,64.77
  pour Top (isolate 0.508): 34.54,65.28 33.53,64.26 33.53,51.82 35.31,50.04 38.86,50.04 39.62,50.8 39.62,65.02 39.37,65.28
  pour Top (isolate 0.508): 73.15,62.99 73.15,49.53 77.98,49.53 77.98,62.99
ALERT_1  (via drill 0.35)
  Top 0.203: U$8.09 6.86,92.96 8.64,94.74 25.91,94.74 26.16,94.74 26.67,94.74 26.92,94.74 27.69,93.98 v27.69,92.96
  Bottom 0.203: v27.69,92.96 27.69,82.04 27.18,81.53 25.65,81.53 23.21,83.98 DATA_CON_CONN.14
ALERT_2  (via drill 0.35)
  Top 0.152: 25.4,93.98 v26.42,92.96
  Top 0.203: U$8.10 9.4,93.22 10.16,93.98 24.38,93.98 25.4,93.98 | v25.91,83.06 24.89,83.06 23.81,81.98 DATA_CON_CONN.12
  Bottom 0.203: v25.91,83.06 26.42,83.57 v26.42,92.96
C2_1  (via drill 0.35)
  Top 0.203: v15.75,87.38 15.75,80.52 16.29,79.98 DATA_CON_CONN.9
  Bottom 0.203: U$8.12 15.75,91.19 v15.75,87.38
C2_2
  Bottom 0.203: U$8.13 18.29,91.19 18.29,88.14 16.51,86.36 15.49,86.36 15.11,85.98 15.11,78.61 15.75,77.98 DATA_CON_CONN.7
CAN_H  (via drill 0.35, 0.55)
  Top 0.203: DATA_CON_CONN.10 52.7,79.98 R5.1 57.4,76.45 57.91,76.96 57.91,78.23 62.99,83.31 62.99,84.07 62.23,84.84 61.47,84.84 60.45,83.82 55.12,83.82 54.23,84.71 54.23,86.74 53.85,87.12 51.56,87.12 v51.31,87.38 | v70.61,90.68 70.1,91.19 v66.04,91.19 | v54.36,95.5 54.1,95.25 53.09,95.25 52.32,96.01 52.32,97.79 52.07,98.04 CAN_DEBUG.3 51.05,97.71 v51.05,96.01 | v110.74,88.9 112.52,87.12 115.06,87.12 115.57,86.61 PI_SHIELD_CONN1.13 | ESC_CONTROLLER.5 79.52,15 82.3,17.78 v109.73,17.78
  Bottom 0.203: v110.74,88.9 72.39,88.9 v70.61,90.68 | v66.04,91.19 65.02,91.19 64.26,91.95 64.26,95.25 64.01,95.5 v54.36,95.5 | v51.05,96.01 51.05,87.63 v51.31,87.38 | PI_SHIELD_CONN1.13 115.57,73.66 117.35,71.88 136.65,71.88 138.18,70.36 138.18,19.05 136.91,17.78 v109.73,17.78
CAN_L  (via drill 0.35, 0.8)
  Top 0.152: R6.2 46.32,75.27 47.24,76.2
  Top 0.203: DATA_CON_CONN.11 17.79,81.98 18.42,81.35 18.42,79.88 19.3,78.99 22.35,78.99 24.38,76.96 24.38,73.41 24.78,73.01 45.95,73.01 46.32,73.37 R6.2 | v50.55,77.22 49.53,76.2 47.24,76.2 | v70.61,92.2 v66.29,92.2 | v90.93,92.2 115.06,92.2 115.57,91.69 PI_SHIELD_CONN1.14 | v126.24,73.15 136.4,73.15 138.58,70.97 138.58,18.03 137.31,16.76 84.07,16.76 81.52,14.21 ESC_CONTROLLER.7
  Bottom 0.203: v50.55,77.22 50.55,80.77 52.83,83.06 v52.83,84.58 52.83,86.11 53.09,86.36 53.09,97.24 CAN_DEBUG.2 54.1,98.04 56.13,96.01 65.28,96.01 65.79,95.5 65.79,92.46 66.04,92.2 v66.29,92.2 | v90.93,92.2 v70.61,92.2 | PI_SHIELD_CONN1.14 116.84,87.12 116.84,74.17 117.86,73.15 v126.24,73.15
CLK
  Top 0.203: U$8.11 10.67,91.19 10.67,86.11 11.43,85.34 12.7,85.34 12.95,85.09 12.95,76.71 13.68,75.98 DATA_CON_CONN.5
DATA  (via drill 0.35)
  Top 0.203: U$8.08 4.32,93.73 6.1,95.5 27.69,95.5 28.96,94.23 v28.96,92.96
  Bottom 0.203: DATA_CON_CONN.4 25.97,73.98 28.96,76.96 v28.96,92.96
GND  (via drill 0.35, 0.55, 0.65, 0.8)
  Top 0.254: U1.8 106.3,83.95 106.93,84.58 v106.93,85.85
  Top 0.508: v121.16,94.49 120.65,93.98 PI_SHIELD_CONN1.10
  Bottom 0.508: CAN_DEBUG.1 65.79,98.04 68.07,95.76 68.07,90.68 67.56,90.17 64.26,90.17 63.75,89.66 v63.75,85.34 | v121.16,94.49 128.78,94.49 v130.3,92.96
  other vias: 63.5,27.69 43.94,84.07 66.04,73.15 75.69,76.45 14.73,33.78 28.19,32.26 34.29,28.19 41.91,27.69 14.73,67.31 28.96,66.55 36.07,76.45 46.74,81.53
  pour Top (isolate 0.508, rank 5): -2.03,102.11 140.21,102.11 140.21,-2.79 0,-2.79 -3.81,1.02 -3.81,100.08 -2.03,101.85
  pour Bottom (isolate 0.508, rank 5): -4.32,100.84 -2.03,103.12 140.72,103.12 140.72,-3.56 -1.27,-3.56 -4.32,-0.51
GPIO1
  Top 0.762: U1.1 125.6,75.06 130.81,80.26 PI_SHIELD_CONN1.1
GPIO2
  Top 0.762: U1.2 124.33,76.33 128.27,80.26 PI_SHIELD_CONN1.3
GPIO3
  Top 0.762: U1.3 122.81,77.6 125.73,80.52 PI_SHIELD_CONN1.5
GPIO4
  Top 0.762: U1.4 121.03,78.87 123.19,81.03 PI_SHIELD_CONN1.7
GPIO5
  Top 0.762: U1.5 119.51,80.14 120.65,81.28 PI_SHIELD_CONN1.9
GPIO6
  Top 0.762: U1.6 117.47,81.41 118.11,82.04 PI_SHIELD_CONN1.11
N$1
  Top 0.254: D6.C 133.47,30.71 R2.1
N$2
  Top 0.762: D5.C 49.92,28.96 R1.1
N$3
  Top 0.254: D7.C 112.38,9.09 R3.1
N$4
  Top 0.203: C1.1 R5.2 54.52,77.56 53.59,78.49 46.99,78.49 44.62,76.11 R6.1
N$5
  Top 0.254: D8.C R7.1
ROBOT_ARM
  Bottom 0.203: PI_SHIELD_CONN1.15 113.03,73.41 117.09,69.34 135.64,69.34 137.16,67.82 137.16,22.61 136.4,21.84 ROBOT_CONN.03
ROBOT_ARM_2  (via drill 0.35)
  Top 0.203: v126.24,70.61 136.4,70.61 137.57,69.44 137.57,20.32 136.55,19.3 ROBOT_CONN.04
  Bottom 0.203: PI_SHIELD_CONN1.16 113.54,88.39 114.3,87.63 114.3,73.41 117.09,70.61 v126.24,70.61
SOL1_1
  Top 0.762: SOLENOID.6 76.08,86.02 87.04,75.06 U1.16
SOL2_1
  Top 0.762: SOLENOID.5 78.58,86.02 88.27,76.33 U1.15
SOL3_1
  Top 0.762: SOLENOID.4 81.08,85.76 89.25,77.6 U1.14
SOL4_1
  Top 0.762: SOLENOID.3 83.58,86.02 90.73,78.87 U1.13
SOL5_1
  Top 0.762: SOLENOID.2 86.08,86.27 92.21,80.14 U1.12
SOL6_1
  Top 0.762: SOLENOID.1 88.58,86.02 93.19,81.41 U1.11

### Text on the board
tNames: 5V LED | 12V LED | 7.4V LED | X15 Backplane / Bryce Sasser / Minh Nguyen / Katherine Sandys / Rachel Livesay / Hyunseok Hong